# Altium schematic sheet Sheet_1_2022-07-26.schdoc
size 264 x 134 mm
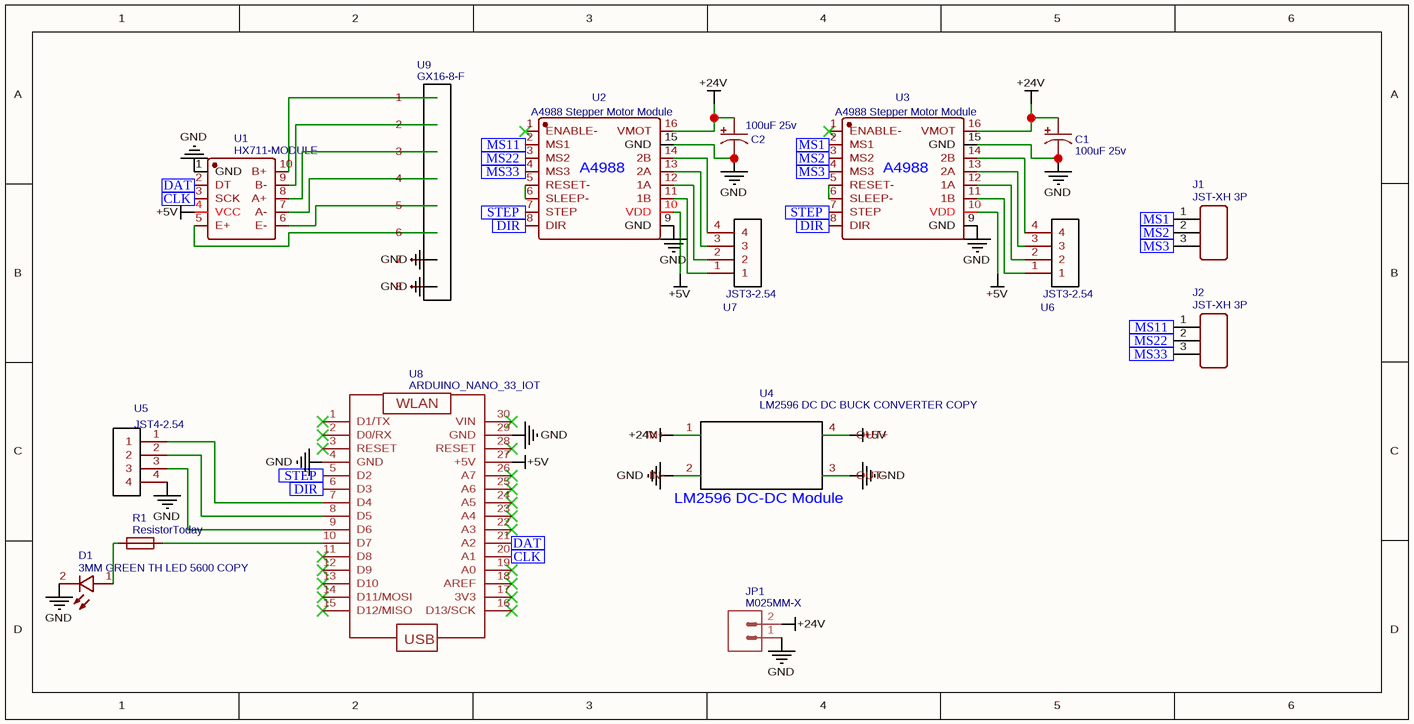
[diagram p0: Sheet_1_2022-07-26.schdoc]

## Parts
C1  100uF 25v  [100UF/25V]
C2  100uF 25v  [100UF/25V]
D1  3MM GREEN TH LED 5600 COPY  [LED-TH_LED-DP2-2LED]
J1  JST-XH 3P  [3PIN_2.54_MM_JST_XHP_JST_CONNECTOR_FOR_DC_SOCKET]
J2  JST-XH 3P  [3PIN_2.54_MM_JST_XHP_JST_CONNECTOR_FOR_DC_SOCKET]
JP1  M025MM-X  [SCREWTERMINAL-5MM-2-X]
R1  ResistorToday  [AXIAL-0.6]
U1  HX711-MODULE  [HX711-MODULE]
U2  A4988 Stepper Motor Module  [A4988MODULE]
U3  A4988 Stepper Motor Module  [A4988MODULE]
U4  LM2596 DC DC BUCK CONVERTER COPY  [LM2596]
U5  JST4-2.54  [JST4-2.54]  (value not drawn)
U6  JST4-2.54  [JST4-2.54]  (value not drawn)
U7  JST4-2.54  [JST4-2.54]  (value not drawn)
U8  ARDUINO_NANO_33_IOT  [ARDUINO_NANO_33_IOT]
U9  GX16-8-F  [GX16-8-2A]

## Ports
CLK (in), DAT (in), DIR (in), MS1 (in), MS2 (in), MS3 (in), MS11 (in), MS22 (in), MS33 (in), STEP (in)

## Nets
+5V: U1.4(VCC) U2.10(VDD) U3.10(VDD) U4.4(OUT+) U8.27(+5V)
+24V: C1.1 C2.1 JP1.2 U2.16(VMOT) U3.16(VMOT) U4.1(IN+)
GND: C1.2 C2.2 D1.2(K) JP1.1 U1.1(GND) U2.9(GND) U2.15(GND) U3.9(GND) U3.15(GND) U4.2(IN-) U4.3(OUT-) U5.4 U8.4(GND) U8.29(GND) U9.7 U9.8
CLK: U1.3(SCK) U8.20(A1) ; port CLK
DAT: U1.2(DT) U8.21(A2) ; port DAT
DIR: U2.8(DIR) U3.8(DIR) U8.6(D3) ; port DIR
MS1: J1.1 U3.2(MS1) ; port MS1
MS2: J1.2 U3.3(MS2) ; port MS2
MS3: J1.3 U3.4(MS3) ; port MS3
MS11: J2.1 U2.2(MS1) ; port MS11
MS22: J2.2 U2.3(MS2) ; port MS22
MS33: J2.3 U2.4(MS3) ; port MS33
STEP: U2.7(STEP) U3.7(STEP) U8.5(D2) ; port STEP
NetD1_1: D1.1(A) R1.1
NetR1_2: R1.2 U8.10(D7)
NetU1_5: U1.5(E+) U9.6
NetU1_6: U1.6(E-) U9.5
NetU1_7: U1.7(A-) U9.4
NetU1_8: U1.8(A+) U9.3
NetU1_9: U1.9(B-) U9.2
NetU1_10: U1.10(B+) U9.1
NetU2_5: U2.5(RESET-) U2.6(SLEEP-)
NetU2_11: U2.11(1B) U7.1
NetU2_12: U2.12(1A) U7.2
NetU2_13: U2.13(2A) U7.3
NetU2_14: U2.14(2B) U7.4
NetU3_5: U3.5(RESET-) U3.6(SLEEP-)
NetU3_11: U3.11(1B) U6.1
NetU3_12: U3.12(1A) U6.2
NetU3_13: U3.13(2A) U6.3
NetU3_14: U3.14(2B) U6.4
NetU5_1: U5.1 U8.7(D4)
NetU5_2: U5.2 U8.8(D5)
NetU5_3: U5.3 U8.9(D6)

Not connected (* = marked no-connect by the designer): U2 1(ENABLE-)*; U3 1(ENABLE-)*; U8 1(D1/TX)* 2(D0/RX)* 3(RESET)* 11(D8)* 12(D9)* 13(D10)* 14(D11/MOSI)* 15(D12/MISO)* 16(D13/SCK)* 17(3V3)* 18(AREF)* 19(A0)* 22(A3)* 23(A4)* 24(A5)* 25(A6)* 26(A7)* 28(RESET)* 30(VIN)*

## Notes on the sheet
- (in symbol A4988 Stepper Motor Module) A4988
- (in symbol ARDUINO_NANO_33_IOT) WLAN; USB
- (in symbol JST4-2.54) JST3-2.54
- (in symbol LM2596 DC DC BUCK CONVERTER COPY) LM2596 DC-DC Module

## Library data of the parts
C1 C2 = 100uF 25v: nameAlias: Capacitance; Contributor: dr.alex; BOM_Manufacturer Part: -; spicePre: C; spiceSymbolName: 100UF/25V
D1 = 3MM GREEN TH LED 5600 COPY: BOM_Manufacturer: VccLite; BOM_Manufacturer Part: 5600; Contributor: AlexKatsovich; BOM_Supplier: Digi-Key; BOM_Supplier Part: L20325-ND; link: https://vcclite.com/product/5602f5-5v/; spicePre: D; spiceSymbolName: 3MM GREEN TH LED 5600 COPY
J1 J2 = JST-XH 3P: Contributor: moorpcbs; spicePre: J; spiceSymbolName: JST-XH 3P
JP1 = M025MM-X: Contributor: Matthew Smith; spicePre: J; spiceSymbolName: M025MM-X
R1 = ResistorToday: BOM_Manufacturer Part: EWWR0001J20R0T9; nameAlias: Value; Contributor: bine1; BOM_Supplier: LCSC; BOM_Supplier Part: X16151710; BOM_Manufacturer: ResistorToday; spicePre: R; spiceSymbolName: condensator
U1 = HX711-MODULE: Contributor: hashimoto; spicePre: U; spiceSymbolName: HX711-MODULE
U2 U3 = A4988 Stepper Motor Module: Contributor: remomansour; spicePre: U; spiceSymbolName: A4988 Stepper Motor Module
U4 = LM2596 DC DC BUCK CONVERTER COPY: Contributor: Wez1; spicePre: U; spiceSymbolName: LM2596 DC DC BUCK CONVERTER COPY
U5-U7 = JST4-2.54: BOM_Manufacturer: JST; Contributor: WillsonEngineering; spicePre: U; spiceSymbolName: JST4-2.54
U8 = ARDUINO_NANO_33_IOT: sourceId: KGSeAWhDB; Contributor: jjmens; timeStamp: 1452340004; spicePre: U; spiceSymbolName: ARDUINO_NANO_33_IOT
U9 = GX16-8-F: BOM_Manufacturer Part: IMC200-GX16-8-F-cct; Contributor: astonfrancis; BOM_Supplier Part: IMC200-GX16-8-F; spicePre: U; spiceSymbolName: GX16-8-F